# Altium schematic sheet Solar.SchDoc: =ProjectName
size A4; CheckedBy: DatNB; Author: Ven; CompanyName: Nacentech; Organization: IMET
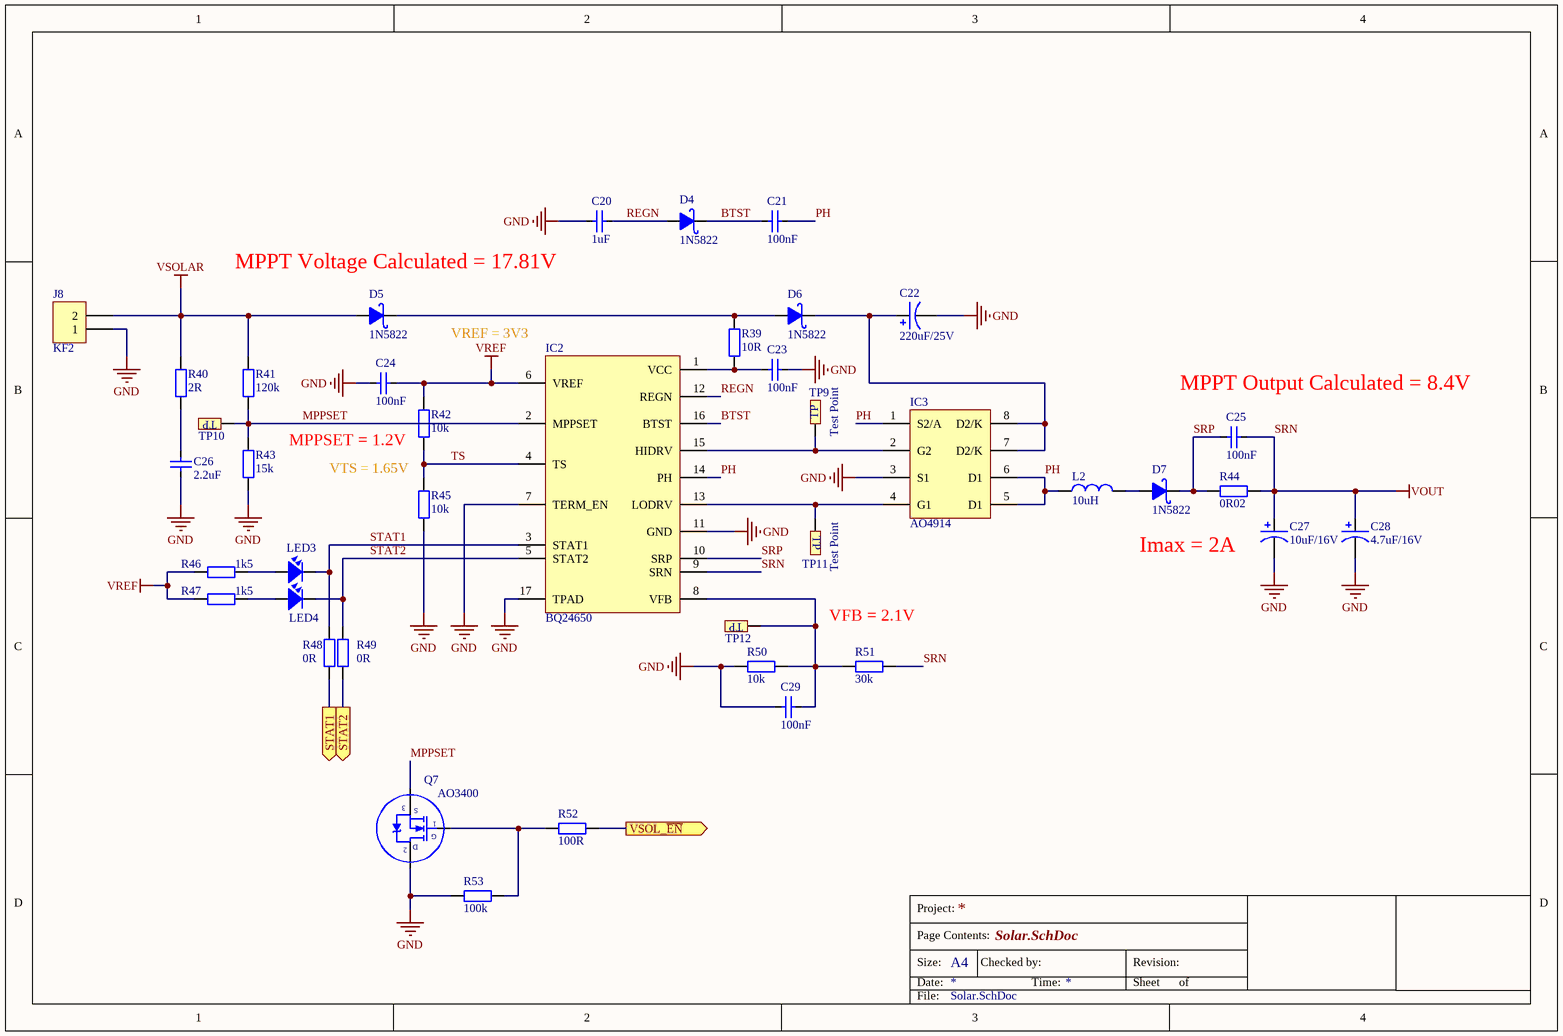
[diagram p0: Solar.SchDoc]

## Parts
C20  1uF  [CAP_0805]
C21  100nF  [CAP_0805]
C22  220uF/25V  [C5mm]
C23  100nF  [CAP_0805]
C24  100nF  [CAP_0805]
C25  100nF  [CAP_0805]
C26  2.2uF  [CAP_0805]
C27  10uF/16V  [C5mm]
C28  4.7uF/16V  [C5mm]
C29  100nF  [CAP_0805]
D4  1N5822  [DIO-214AC(SMA)]
D5  1N5822  [DIO-214AC(SMA)]
D6  1N5822  [DIO-214AC(SMA)]
D7  1N5822  [DIO-214AC(SMA)]
IC2  BQ24650  [VQFN-16]
IC3  AO4914  [SOIC-8]
J8  KF2  [KF2-5.08]
L2  10uH  [L-SMD-M-7.3x4.5]
LED3  LED  [LED-0805-Red]  (value not drawn)
LED4  LED  [LED-0805-Orange]  (value not drawn)
Q7  AO3400  [SOT23A]
R39  10R  [RES-SMD-0805]
R40  2R  [RES-SMD-0805]
R41  120k  [RES-SMD-0805]
R42  10k  [RES-SMD-0805]
R43  15k  [RES-SMD-0805]
R44  0R02  [RES-SMD-2512]
R45  10k  [RES-SMD-0805]
R46  1k5  [RES-SMD-0805]
R47  1k5  [RES-SMD-0805]
R48  0R  [RES-SMD-0805]
R49  0R  [RES-SMD-0805]
R50  10k  [RES-SMD-0805]
R51  30k  [RES-SMD-0805]
R52  100R  [RES-SMD-0805]
R53  100k  [RES-SMD-0805]
TP9  Test Point  [TP_SMD]
TP10  Test Point  [TP_SMD]  (value not drawn)
TP11  Test Point  [TP_SMD]
TP12  Test Point  [TP_SMD]  (value not drawn)

## Ports
STAT1 (out), STAT2 (out), VSOL_~{EN} (out)

## Nets
GND: C20.2 C22.2 C23.2 C24.2 C26.1 C27.2 C28.2 C29.1 IC2.7(TERM_EN) IC2.11(GND) IC2.17(TPAD) IC3.3(S1) J8.1 Q7.2(D) R43.2 R45.1 R50.1 R53.2
SRN: C25.1 C27.1 C28.1 IC2.9(SRN) R44.2 R51.1  [also labelled VOUT]
VREF: C24.1 IC2.6(VREF) R42.1 R46.1 R47.1
VSOLAR: D5.1(A) J8.2 R40.1 R41.2
BTST: C21.1 D4.2(K) IC2.16(BTST)
MPPSET: IC2.2(MPPSET) Q7.3(S) R41.1 R43.1 TP10.1
PH: C21.2 IC2.14(PH) IC3.1(S2/A) IC3.5(D1) IC3.6(D1) L2.1
REGN: C20.1 D4.1(A) IC2.12(REGN)
SRP: C25.2 D7.2(K) IC2.10(SRP) R44.1
STAT1: IC2.3(STAT1) LED3.2 R48.2
STAT1: R48.1 ; port STAT1  [a separate net that carries the same name]
STAT2: IC2.5(STAT2) LED4.2 R49.2
STAT2: R49.1 ; port STAT2  [a separate net that carries the same name]
TS: IC2.4(TS) R42.2 R45.2
VSOL_~{EN}: R52.2 ; port VSOL_~{EN}
NetC22_1: C22.1 D6.2(K) IC3.7(D2/K) IC3.8(D2/K)
NetC23_1: C23.1 IC2.1(VCC) R39.2
NetC26_2: C26.2 R40.2
NetC29_2: C29.2 IC2.8(VFB) R50.2 R51.2 TP12.1
NetD5_2: D5.2(K) D6.1(A) R39.1
NetD7_1: D7.1(A) L2.2
NetIC2_13: IC2.13(LODRV) IC3.4(G1) TP11.1
NetIC2_15: IC2.15(HIDRV) IC3.2(G2) TP9.1
NetLED3_1: LED3.1 R46.2
NetLED4_1: LED4.1 R47.2
NetQ7_1: Q7.1(G) R52.1 R53.1

## Notes on the sheet
- MPPT Voltage Calculated = 17.81V
- (near IC2) VREF = 3V3
- MPPSET = 1.2V
- (near C25) MPPT Output Calculated = 8.4V
- VTS = 1.65V
- Imax = 2A
- (near R51) VFB = 2.1V
- Project:
- Page Contents:
- Size:
- Date:
- A4
- Checked by:
- Time:
- Revision:
- Sheet
- of
- File:

## Library data of the parts
C20 C21 C23-C26 C29 = CapSMD: Capacitor; Value: 33p; Published: 8-Jun-2000; LatestRevisionDate: 17-Jul-2002; LatestRevisionNote: Re-released for DXP Platform.; PackageReference: RAD-0.3; Publisher: Altium Limited
C22 C27 C28 = Cap Pol: Polarized Capacitor (Axial); Published: 8-Jun-2000; LatestRevisionDate: 17-Jul-2002; LatestRevisionNote: Re-released for DXP Platform.; PackageReference: POLAR0.8; Publisher: Altium Limited
D4-D7 = 1N5822: Schottky Rectifiers; Value: Diode c?m 1N5408
IC2 = BQ24650: BQ24650 Stand-Alone Synchronous Buck Battery Charge Controller for Solar Power / With Maximum Power Point Tracking
IC3 = AO4914: Dual N-Channel Enhancement Mode Field Effect Transistor with Schottky Diode
J8 = KF2: Manufacturer: Würth Elektronik eiSos GmbH; partNo: 691103110002; ComponentLink1 Description: Manufacturer; ComponentLink2 Description: Datasheet; NoPins: 2; Created Date: 29 October 2013; ComponentLink1URL: http://www.we-online.com; ComponentLink2URL: http://katalog.we-online.de/em/datasheet/6911031100xx.pdf; Created by: Karrer Zheng
L2 = Inductor: Value: 150 mH
LED3 LED4 = LED: LED Single colour Green and Red; Value: LED 3 ly Single Colour
Q7 = MOSFET_N: Generic N Channel MOSFET
R39-R53 = Resistor - SMD: Resistor SMD; Manufacturer: Generic Components; Class: Passive; Published: 08/06/2000; Publisher: Altium Hobart Technology Centre
TP9-TP12 = TP: CONNECT 1